# Altium schematic sheet MAX17048.SchDoc
size A4; SheetNumber: 5; SheetTotal: 17
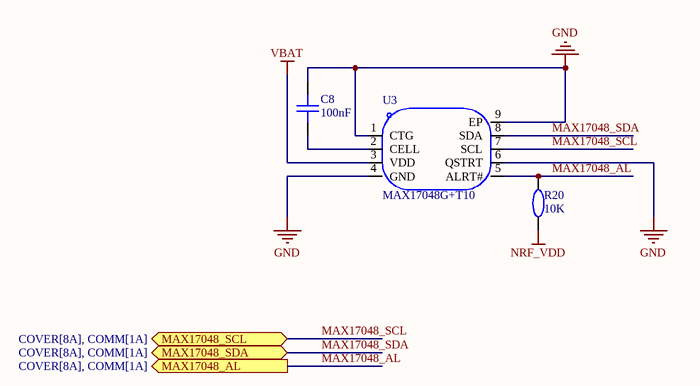
[diagram p0: MAX17048.SchDoc]

## Parts
C8  100nF  [C0402]
R20  10K  [R0402]
U3  MAX17048G+T10  [DFN-8_L2.0-W2.0-P0.50-BL-EP]

## Ports
MAX17048_AL (out, see COVER[8A], COMM[1A]), MAX17048_SCL (bidir, see COVER[8A], COMM[1A]), MAX17048_SDA (bidir, see COVER[8A], COMM[1A])

## Nets
GND: C8.2 U3.1(CTG) U3.4(GND) U3.6(QSTRT) U3.9(EP)
NRF_VDD: R20.1
VBAT: U3.3(VDD)
MAX17048_AL: R20.2 U3.5(ALRT#) ; port MAX17048_AL
MAX17048_SCL: U3.7(SCL) ; port MAX17048_SCL
MAX17048_SDA: U3.8(SDA) ; port MAX17048_SDA
NetC8_1: C8.1 U3.2(CELL)

## Library data of the parts
C8 = CAP_0402: Symbol: CapAcitance; Device: CAP_0603; Convert to PCB: yes; Add into BOM: yes; Supplier Footprint: 0603; Value: 100nF; Name: 100nF
R20 = Res_0402: Symbol: 电阻; Device: Res_0603; Convert to PCB: yes; Add into BOM: yes; Supplier Footprint: 0603; Value: 10K; Name: 10K
U3 = MAX17048G+T10: Manufacturer: ADI(亚德诺)/MAXIM(美信); Add into BOM: yes; The Chip Type: 电池监测芯片; Type of Battery: 锂离子/聚合物; Number of Cells: 1; Symbol: MAX17048G+T10; Device: MAX17048G+T10; LCSC Part Name: MAX17048G+T10; Supplier Part: C2682616; Manufacturer Part: MAX17048G+T10; Supplier Footprint: DFN-8-EP(2x2); Datasheet: https://atta.szlcsc.com/upload/public/pdf/source/20210106/C2682616_818568B5D3BA4B627110FCAA33E0BFB1.pdf; Supplier: LCSC; Convert to PCB: yes; Operating Temperature: -20℃~+70℃; Name: MAX17048G+T10